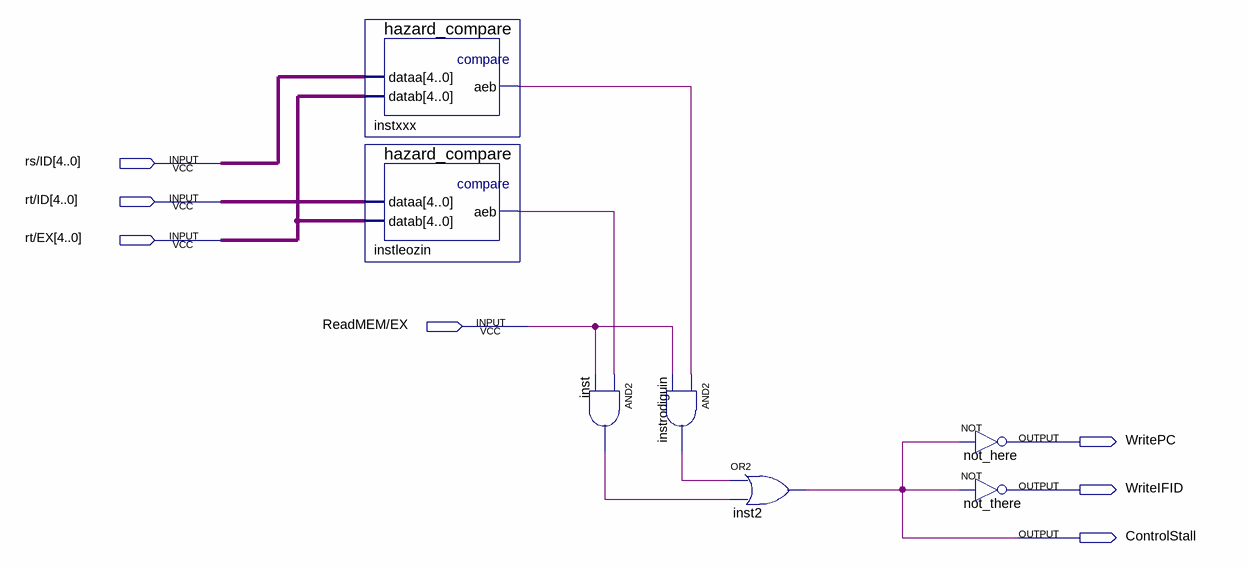
[diagram p0: schematic sheet]
// Quartus schematic hazard_detection.bdf as structural Verilog: 7 symbols, 7 pins
module hazard_detection (
  input  [4:0] \rs/ID ,
  input  [4:0] \rt/ID ,
  input  [4:0] \rt/EX ,
  input  \ReadMEM/EX ,
  output WritePC,
  output WriteIFID,
  output ControlStall
);

  wire inst_out, instleozin_aeb, instrodiguin_out, instxxx_aeb;

  hazard_compare instxxx (.dataa(\rs/ID ), .datab(\rt/EX ), .aeb(instxxx_aeb));
  hazard_compare instleozin (.dataa(\rt/ID ), .datab(\rt/EX ), .aeb(instleozin_aeb));
  and inst (inst_out, instleozin_aeb, \ReadMEM/EX );
  and instrodiguin (instrodiguin_out, instxxx_aeb, \ReadMEM/EX );
  or inst2 (ControlStall, instrodiguin_out, inst_out);
  not not_here (WritePC, ControlStall);
  not not_there (WriteIFID, ControlStall);
endmodule
